# Altium schematic sheet USB.SchDoc: USB
size 292 x 193 mm; Date: 30 08 2013; Author: Rachid AKKOUCHE; CompanyName: RASoftware; DrawnBy: Rachid AKKOUCHE; Engineer: Rachid AKKOUCHE; Organization: RASoftware; Address1: 52 J03, rue de la crèche; Address2: 77100 MEAUX; Address3: FRANCE; DocumentNumber: BRA201308309B; Revision: B; SheetNumber: 9; SheetTotal: 10; Telephone: +33651604047; Email: rachid.akkouche@wanadoo.fr; Proprietaire: MDI System; Time: 19:00
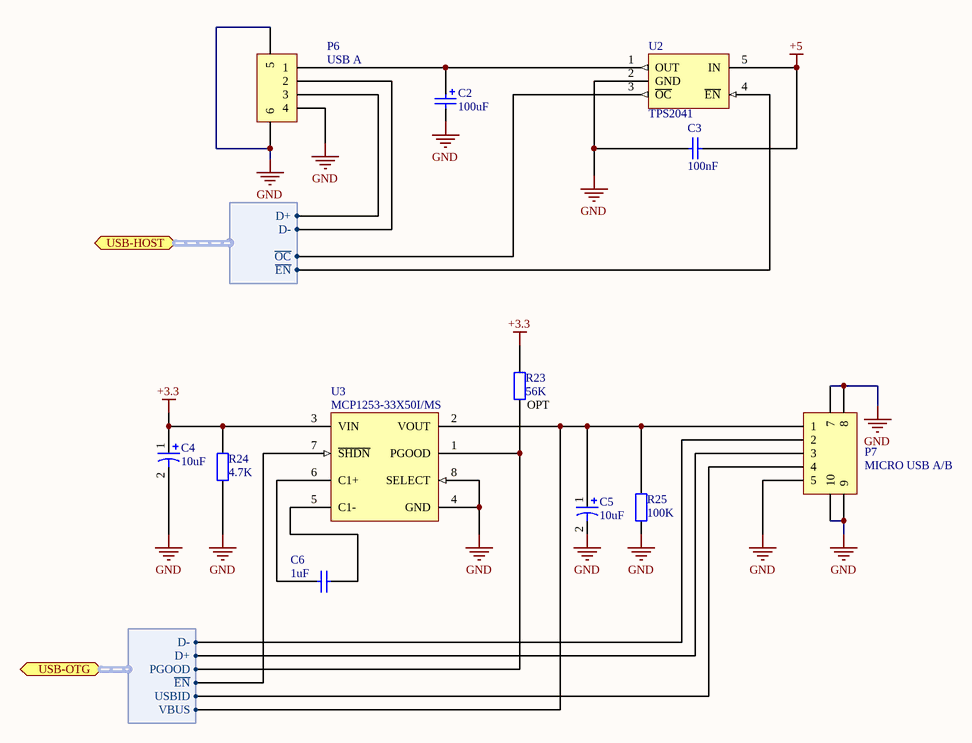
[diagram p0: USB.SchDoc]

## Parts
C2  100uF  [Kemet_63]
C3  100nF  [C0805]
C4  10uF  [KEMET_4]
C5  10uF  [KEMET_4]
C6  1uF  [C0805]
P6  USB A  [USB  2410 06]
P7  MICRO USB A/B  [USB FCI 10104111]
R23  56K  [R0805]
R24  4.7K  [R0805]
R25  100K  [R0805]
U2  TPS2041  [SOT23-5]
U3  MCP1253-33X50I/MS  [MSOP-8]

## Ports
USB-HOST (harness USB-HOST), USB-OTG (harness USG-OTG)

## Harnesses
USB-HOST: D-, D+, ~{OC}, ~{EN}
USG-OTG: PGOOD, D-, D+, ~{EN}, USBID, VBUS

## Nets
+3.3: C4.1 R23.1 R24.2 U3.3(VIN)
+5: C3.1 U2.5(IN)
GND: C2.2 C3.2 C4.2 C5.2 P6.4 P6.5 P6.6 P7.5 P7.7 P7.8 P7.9 P7.10 R24.1 R25.1 U2.2(GND) U3.4(GND) U3.8(SELECT)
NetC2_1: C2.1 P6.1 U2.1(OUT)
NetC5_1: C5.1 P7.1 R25.2 U3.2(VOUT) ; port USB-OTG.VBUS
NetC6_1: C6.1 U3.6(C1+)
NetC6_2: C6.2 U3.5(C1-)
NetP6_2: P6.2 ; port USB-HOST.D-
NetP6_3: P6.3 ; port USB-HOST.D+
NetP7_2: P7.2 ; port USB-OTG.D-
NetP7_3: P7.3 ; port USB-OTG.D+
NetP7_4: P7.4 ; port USB-OTG.USBID
NetR23_2: R23.2 U3.1(PGOOD) ; port USB-OTG.PGOOD
NetU2_3: U2.3(~{OC}) ; port USB-HOST.~{OC}
NetU2_4: U2.4(~{EN}) ; port USB-HOST.~{EN}
NetU3_7: U3.7(~{SHDN}) ; port USB-OTG.~{EN}

## Notes on the sheet
- (near R23) OPT
- Project:
- Ce document est la propriété de
- il ne peut être divulgué sans l'accord écrit de l'un de ses représentants dûment mandaté.
- Title:
- Number:
- Date:
- Draw by:
- Time
- Sheet:       of:
- REV.
- File:
- Size:
- A4

## Library data of the parts
C2 = Cap Pol 100uF: Polarized Capacitor; Manufacturer: EPCOS; Manufacturer Part Number: B41142A4107M; Product Range: EPCOS - B41142 Series; Capacité: 100; Tolérance de capacité: ± 20%; Tension: 16; Type de boîtier de condensateur: Radial Can - SMD; Diamètre: 6.3; Résistance, ESR: 0.16; Hauteur: 7.7; Courant d'ondulation c.a.: 300; Type de packaging: Cut Tape; Durée de vie @ température: 2000 heures @ 105; Température d'utilisation min: -55; Température de fonctionnement max..: 105; SVHC: No SVHC (19-Dec-2012); Impédance: 0.26; Température de fonctionnement: -55°C à +105; Température, ESR: 20; Type de boîtier: CMS; Supplier 1: Farnell; RoHS: YES; Pricing 1: 10=0,123, 50=0,095, 100=0,078, 250=0,07, 1000=0,062 (EUR); Courant d'ondulation c.a. à  100Hz: 300; Fréquence, impédance: 100; Longueur/hauteur: 7.7; Température, courant ondulatoire: 105; Température, impédance: 20; ComponentLink1URL: http://www.epcos.com/inf/20/30/db/alu_x/B41142.pdf; ComponentLink1Description: http://www.epcos.com/inf/20/30/db/alu_x/B41142.pdf; Supplier Part Number 1: 1735328
C3 = Cap 0805 100nF: Capacitor; Manufacturer: MULTICOMP; Manufacturer Part Number: MCCA000296; Supplier 1: Farnell; Supplier Part Number 1: 1759167; Pricing 1: 100=0,01, 500=0,008, 1000=0,006, 4000=0,005 (EUR); ComponentLink1URL: http://www.farnell.com/datasheets/1520827.pdf; ComponentLink1Description: http://www.farnell.com/datasheets/1520827.pdf
C4 C5 = Cap Pol1: Polarized Capacitor; Manufacturer: KEMET; Manufacturer Part Number: EXV106M025A9BAA; Supplier 1: Farnell; Supplier Part Number 1: 2069174; RoHS: YES; Pricing 1: 10=0,111, 100=0,085, 500=0,074, 1000=0,07, 5000=0,066 (EUR); ComponentLink1URL: http://www.farnell.com/datasheets/1500293.pdf; ComponentLink1Description: http://www.farnell.com/datasheets/1500293.pdf
C6 = Cap 0805 1uF: Capacitor; Manufacturer: MULTICOMP; Manufacturer Part Number: MCCA000549; Product Range: MULTICOMP - MCCA Series; Capacité: 1; Tolérance de capacité: +80%, -20%; Diélectrique: Y5; Type de boîtier de condensateur: 0805 [2012 Metric]; Type de packaging: Cut Tape; SVHC: No SVHC (20-Jun-2013); Capacitor Terminals: SMD; Température de fonctionnement: -30°C à +85; Supplier 1: Farnell; RoHS: YES; Pricing 1: 100=0,018, 500=0,012, 1000=0,009, 3000=0,006 (EUR); ComponentLink1URL: http://www.farnell.com/datasheets/1723208.pdf; ComponentLink1Description: http://www.farnell.com/datasheets/1723208.pdf; Supplier Part Number 1: 1759429
P6 = Header 4_1: USB 2.0 Connector A; Manufacturer: LUMBERG; Manufacturer Part Number: 2410 06; Type de connecteur: USB Type A; Série: 2410; Genre: Embase; Nombre de contacts: 4; Terminaison du contact: A souder; Montage connecteur: CI; Plaquage du contact: Or; Matériau du contact: Cuivre; SVHC: No SVHC (19-Dec-2012); Body Plating: Etain; Courant: 1; Montage, orientation: 90°; Nombre de cycles d'accouplements: 1500; Plaquage borne: Tin; Résistance, contact: 30; Température de fonctionnement max..: +105; Température d'utilisation min: -55; Tension, vérification: 750; Type de montage: Montage en surface; Supplier 1: Farnell; Supplier Part Number 1: 1308874; RoHS: YES; Pricing 1: 1=0,63, 10=0,53, 50=0,51, 100=0,48 (EUR); Contact Material: CuSn; Tension c.a.: 30; ComponentLink1URL: http://www.farnell.com/datasheets/1715380.pdf; ComponentLink1Description: http://www.farnell.com/datasheets/1715380.pdf
P7 = Header 5: Header, 5-Pin; Manufacturer: FCI; Manufacturer Part Number: 10104111-0001LF; Type de connecteur: USB Micro A/B; Série: 10104111; Genre: Embase; Nombre de contacts: 5; Terminaison du contact: Montage en surface à angle droit; Montage connecteur: CI; Plaquage du contact: Or; Matériau du contact: Cuivre; SVHC: No SVHC (20-Jun-2013); LatestRevisionDate: 17-Jul-2002; LatestRevisionNote: Re-released for DXP Platform.; Publisher: Altium Limited; Supplier 1: Farnell; Supplier Part Number 1: 2293755; RoHS: YES; Pricing 1: 1=0,98, 10=0,84, 25=0,76, 50=0,67, 100=0,64, 250=0,57 (EUR); ComponentLink1URL: http://portal.fciconnect.com/Comergent//fci/drawing/10104111.pdf; ComponentLink1Description: http://portal.fciconnect.com/Comergent//fci/drawing/10104111.pdf
R23 = Resistor 0805 56K: Resistor; Manufacturer: MULTICOMP; Manufacturer Part Number: MC0.1W08051%56KFR; Product Range: MULTICOMP - MC Series; Résistance: 56; Puissance: 100; Tolérance de résistance: ± 1%; Type de boîtier de résistance: 0805; Type de résistance: Couche épaisse; Coefficient de température: ± 100; Tension: 150; Type de packaging: Full Reel; Resistor Mounting: CMS; Resistor Terminals: (Non Disponible); Supplier 1: Farnell; RoHS: YES; Pricing 1: 5000=0,001 (EUR); MSL: (Non Applicable); ComponentLink1URL: http://www.farnell.com/datasheets/1716700.pdf; ComponentLink1Description: http://www.farnell.com/datasheets/1716700.pdf; Supplier Part Number 1: 2129258
R24 = Resistor 0805 4.7K: Resistor; Manufacturer: MULTICOMP; Manufacturer Part Number: MC01W080514K7; Product Range: MULTICOMP - MC Series; Résistance: 4.7; Puissance: 100; Tolérance de résistance: ± 1%; Type de boîtier de résistance: 0805; Type de résistance: Couche épaisse; Coefficient de température: ± 100; Tension: 150; Type de packaging: Full Reel; SVHC: No SVHC (20-Jun-2013); Resistor Mounting: CMS; Supplier 1: Farnell; RoHS: YES; Pricing 1: 5000=0,001 (EUR); MSL: (Non Applicable); ComponentLink1URL: http://www.farnell.com/datasheets/1729047.pdf; ComponentLink1Description: http://www.farnell.com/datasheets/1729047.pdf; Supplier Part Number 1: 2129167
R25 = Resistor 0805 100K: Resistor; Manufacturer: MULTICOMP; Manufacturer Part Number: MC0.1W08051%100KFR; Product Range: MULTICOMP - MC Series; Résistance: 100; Tolérance de résistance: ± 1%; Type de boîtier de résistance: 0805; Type de résistance: Couche épaisse; Coefficient de température: ± 100; Tension: 150; Type de packaging: Full Reel; Resistor Mounting: CMS; Supplier 1: Farnell; Supplier Part Number 1: 2129276; RoHS: YES; Pricing 1: 5000=0,001 (EUR); Puissance: 100; MSL: MSL 1 - Illimité; ComponentLink1URL: http://www.farnell.com/datasheets/1716700.pdf; ComponentLink1Description: http://www.farnell.com/datasheets/1716700.pdf
U2 = TPS2041-DBV: Power DIST Switch; Manufacturer: TEXAS INSTRUMENTS; Manufacturer Part Number: TPS2041BDBVR; Supplier 1: Farnell; RoHS: YES; Pricing 1: 1=1,39, 25=1,18, 50=1,08, 100=0,96, 250=0,76 (EUR); ComponentLink1URL: http://www.ti.com/lit/ds/symlink/tps2041b.pdf; ComponentLink1Description: http://www.ti.com/lit/ds/symlink/tps2041b.pdf; ComponentLink2URL: http://www.farnell.com/cad/1619297.zip; ComponentLink2Description: http://www.farnell.com/cad/1619297.zip; Supplier Part Number 1: 1703472
U3 = MCP1253-33X50I/MS: Low Noise, Positive-Regulated Charge Pump, 1MHz, Fixed Output, 8-Pin MSOP, Industrial Temperature; Manufacturer: MICROCHIP; Tension d'entrée primaire: 5.5; Nombre de canaux de sortie: 1; Courant, sortie: 100; Nombre de broches: 8; Température d'utilisation min: -45; Température de fonctionnement max..: 85; SVHC: No SVHC (20-Jun-2013); Courant, sortie max.: 150; Fréquence: 1000; Précision: 2.5%; Racine de la référence: 1253; Température de fonctionnement: -45°C à +85; Tension, alimentation min.: 2; Tension, sortie max..: 5; Type de régulation de tension: Positive, Low Noise; Type de terminaison: SMD; Supplier 1: Farnell; Supplier Part Number 1: 1332067; Manufacturer Part Number: MCP1253-33X50I/MS; RoHS: YES; Pricing 1: 1=1,73, 10=1,23, 100=0,99 (EUR); Tension, sortie: 5.5; Type de boîtier CI régulateur de tension: MSOP; MSL: MSL 1 - Illimité; Marquage composant: MCP1253-33X50; Tension, alimentation max..: 5.5; Tension, entrée max..: 5.5; Type de boîtier: MSOP; ComponentLink1URL: http://ww1.microchip.com/downloads/en/devicedoc/21752a.pdf; ComponentLink1Description: http://ww1.microchip.com/downloads/en/devicedoc/21752a.pdf; ComponentLink2URL: http://www.farnell.com/cad/1545296.zip; ComponentLink2Description: http://www.farnell.com/cad/1545296.zip